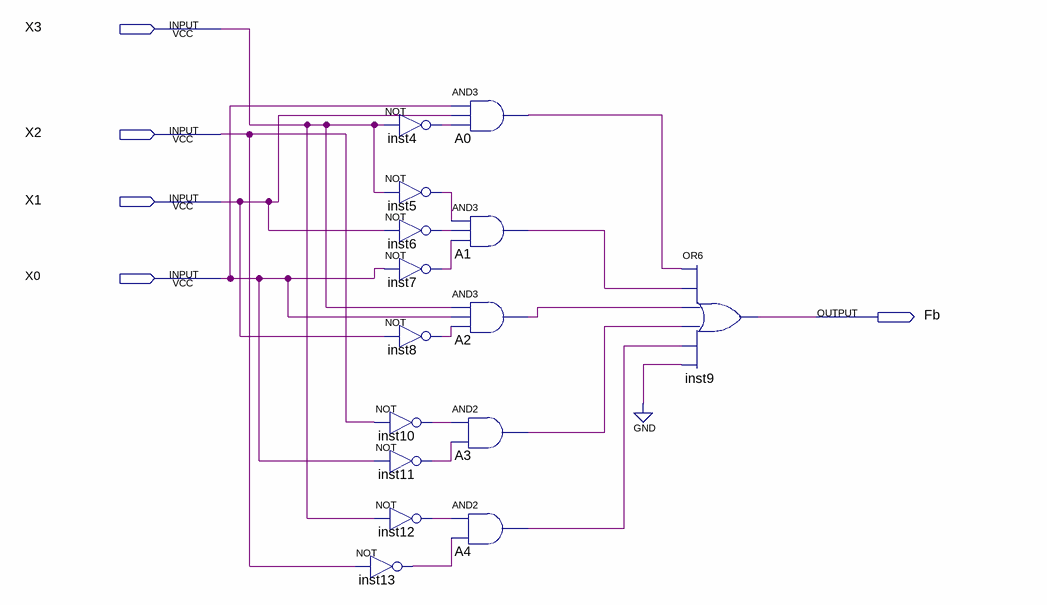
[diagram p0: schematic sheet]
// Quartus schematic Segmento2.bdf as structural Verilog: 15 symbols, 5 pins
module Segmento2 (
  input  X3,
  input  X2,
  input  X1,
  input  X0,
  output Fb
);

  wire A0_out, A1_out, A2_out, A3_out, A4_out, inst4_out, inst5_out, inst6_out, inst7_out, inst8_out,
       inst10_out, inst11_out, inst12_out, inst13_out;

  not inst4 (inst4_out, X3);
  not inst5 (inst5_out, X3);
  not inst6 (inst6_out, X1);
  not inst7 (inst7_out, X0);
  not inst8 (inst8_out, X1);
  not inst10 (inst10_out, X2);
  not inst11 (inst11_out, X0);
  not inst12 (inst12_out, X3);
  not inst13 (inst13_out, X2);
  and A0 (A0_out, X0, X1, inst4_out);
  and A1 (A1_out, inst5_out, inst6_out, inst7_out);
  and A2 (A2_out, X3, X0, inst8_out);
  and A3 (A3_out, inst10_out, inst11_out);
  and A4 (A4_out, inst12_out, inst13_out);
  or inst9 (Fb, A0_out, A1_out, A2_out, A3_out, A4_out, 1'b0);
endmodule
